# Altium schematic sheet Sheet3.SchDoc
size A4
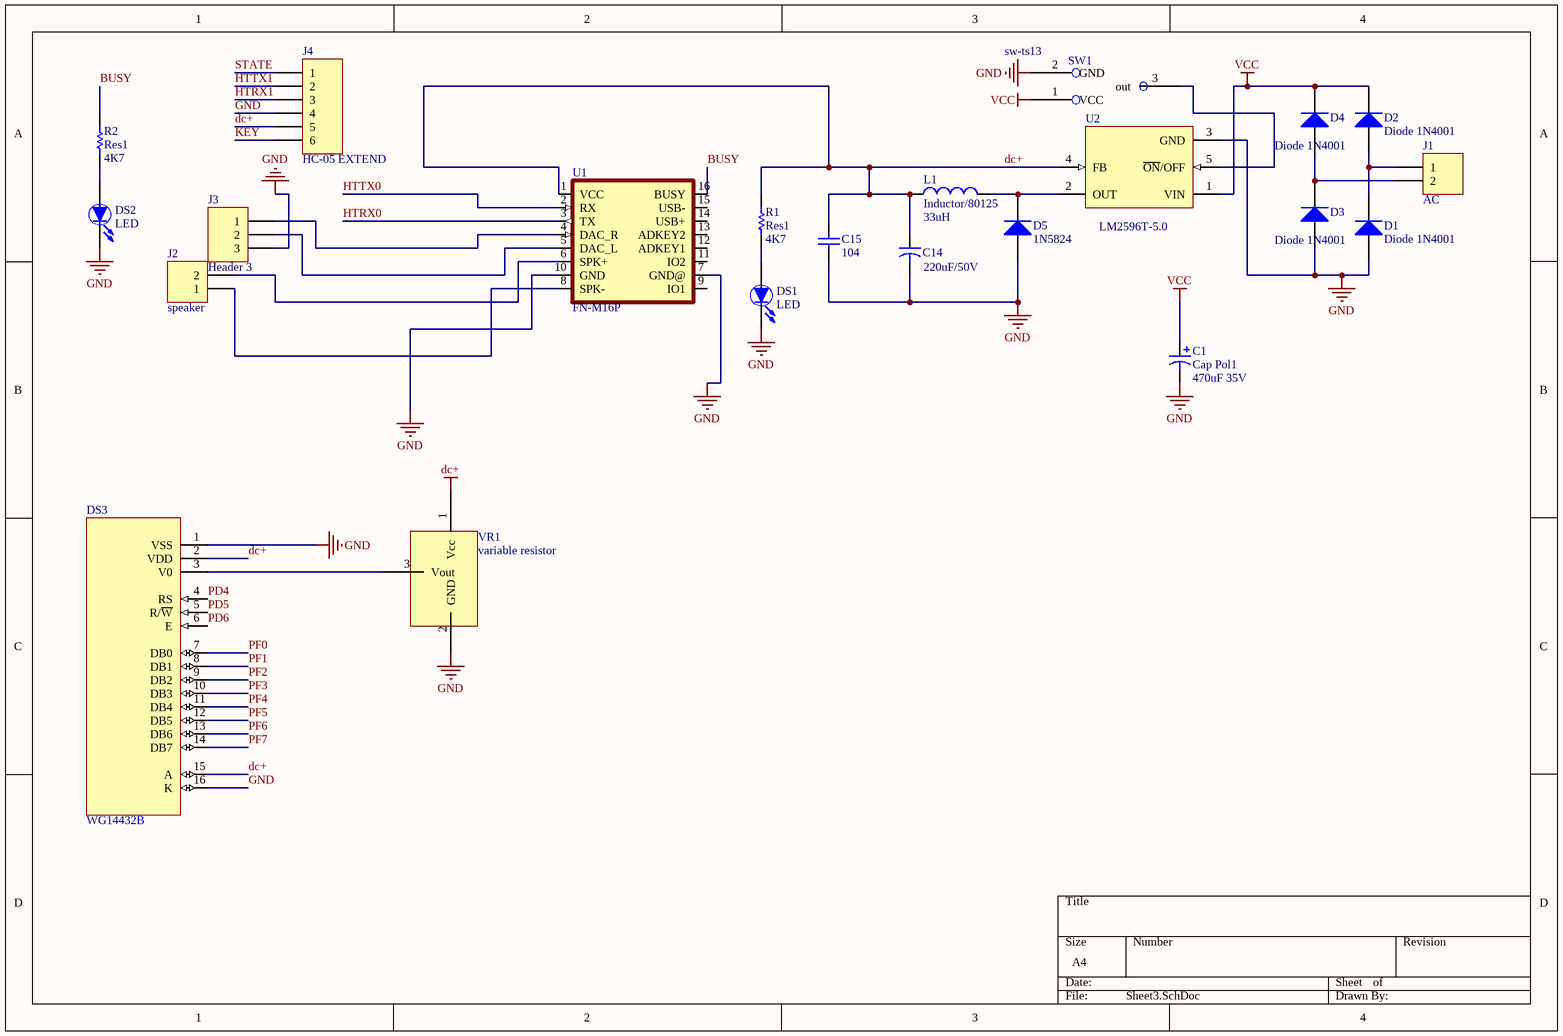
[diagram p0: Sheet3.SchDoc]

## Parts
C1  Cap Pol1  value 470uF 35V  [RB7.6-15]
C14  value 220uF/50V  [CAPR5-4X5]  (hidden comment: Cap2)
C15  104  [C200]
D1  Diode 1N4001  [DO-41]
D2  Diode 1N4001  [DO-41]
D3  Diode 1N4001  [DO-41]
D4  Diode 1N4001  [DO-41]
D5  1N5824  [DO-201AD]
DS1  LED  [LED-3mm_G]
DS2  LED  [LED-3mm_G]
DS3  WG14432B  [LCM_16]
J1  AC  [HDR1X2]
J2  speaker  [HDR1X2]
J3  Header 3  [HDR1X3]
J4  HC-05 EXTEND  [HDR1X6]
L1  Inductor/80125  value 33uH  [T080125]
R1  Res1  value 4K7  [AXIAL-0.3]
R2  Res1  value 4K7  [AXIAL-0.3]
SW1  sw-ts13  [TS-13]
U1  FN-M16P  [FN-M16P]
U2  LM2596T-5.0  [T05D]
VR1  variable resistor  [var_test]

## Nets
dc+: C14.1 C15.2 DS3.2(VDD) DS3.15(A) J4.5 L1.1 R1.2 U1.1(VCC) U2.4(FB) VR1.1(Vcc)
GND: C1.2 C14.2 C15.1 D1.1(A) D3.1(A) D5.1(A) DS1.2(K) DS2.2(K) DS3.1(VSS) DS3.16(K) J3.3 J4.4 SW1.2(GND) U1.7(GND@) U1.10(GND) U2.3(GND) VR1.2(GND)
VCC: C1.1 D2.2(K) D4.2(K) SW1.1(VCC) U2.1(VIN)
BUSY: R2.2 U1.16(BUSY)
HTRX0: U1.3(TX)
HTRX1: J4.3
HTTX0: U1.2(RX)
HTTX1: J4.2
KEY: J4.6
PD4: DS3.4(RS)
PD5: DS3.5(R/~{W})
PD6: DS3.6(E)
PF0: DS3.7(DB0)
PF1: DS3.8(DB1)
PF2: DS3.9(DB2)
PF3: DS3.10(DB3)
PF4: DS3.11(DB4)
PF5: DS3.12(DB5)
PF6: DS3.13(DB6)
PF7: DS3.14(DB7)
STATE: J4.1
NetD1_2: D1.2(K) D2.1(A) J1.1
NetD3_2: D3.2(K) D4.1(A) J1.2
NetD5_2: D5.2(K) L1.2 U2.2(OUT)
NetDS1_1: DS1.1(A) R1.1
NetDS2_1: DS2.1(A) R2.1
NetDS3_3: DS3.3(V0) VR1.3(Vout)
NetJ2_1: J2.1 U1.8(SPK-)
NetJ2_2: J2.2 U1.6(SPK+)
NetJ3_1: J3.1 U1.4(DAC_R)
NetJ3_2: J3.2 U1.5(DAC_L)
NetSW1_3: SW1.3(out) U2.5(~{ON}/OFF)

Not connected (* = marked no-connect by the designer): U1 9(IO1) 11(IO2) 12(ADKEY1) 13(ADKEY2) 14(USB+) 15(USB-)

## Library data of the parts
C1 = Cap Pol1: Polarized Capacitor (Radial); Published: 8-Jun-2000; LatestRevisionDate: 17-Jul-2002; LatestRevisionNote: Re-released for DXP Platform.; PackageReference: RB7.6-15; Publisher: Altium Limited; PackageDescription: Polarized Capacitor (Radial); 2 Leads
C14 = Cap2: Capacitor; Published: 23-Sep-2002; PackageReference: CAPR5-4X5; Publisher: Altium Limited; PackageDescription: Capacitor; 2 Leads
C15 = Cap: Capacitor; Published: 8-Jun-2000; LatestRevisionDate: 17-Jul-2002; LatestRevisionNote: Re-released for DXP Platform.; PackageReference: RAD-0.3; Publisher: Altium Limited
D1-D4 = Diode 1N4001: 1 Amp General Purpose Rectifier; Published: 8-Jun-2000; LatestRevisionDate: 17-Jul-2002; LatestRevisionNote: Re-released for DXP Platform.; DatasheetVersion: 1998; PackageVersion: Aug-1999; PackageReference: DO-41; Publisher: Altium Limited; PackageDescription: Diode, Axial; Body 5.2 x 2.7 mm (LxDia. max), Lead Dia. 0.86 mm (max); Code_JEDEC: DO-204-AL; ComponentLink1Description: Manufacturer Link; ComponentLink1URL: http://www.fairchildsemi.com/; ComponentLink2Description: Datasheet; ComponentLink2URL: http://www.fairchildsemi.com/ds/1N%2F1N4001.pdf
D5 = Diode 1N5408: 3 Amp Medium Power Silicon Rectifier Diode; Published: 8-Jun-2000; LatestRevisionDate: 17-Jul-2002; LatestRevisionNote: Re-released for DXP Platform.; DatasheetVersion: Aug-1984; PackageReference: DO-201AD; Publisher: Altium Limited; PackageDescription: Diode, Axial; Body 9.5 x 5.3 mm (LxDia. max), Lead Dia. 1.32 mm (max); ComponentLink1Description: Manufacturer Link; ComponentLink1URL: http://www.irf.com/
DS1 DS2 = LED: Typical INFRARED GaAs LED; Published: 8-Jun-2000; LatestRevisionDate: 08-Jul-2005; LatestRevisionNote: Mech Layer 1 removed.; PackageReference: LED-0; Publisher: Altium Limited
DS3 = WG14432B: LCD Module
J1 J2 = Header 2: Header, 2-Pin; LatestRevisionDate: 17-Jul-2002; LatestRevisionNote: Re-released for DXP Platform.; Publisher: Altium Limited
J3 = Header 3: Header, 3-Pin; LatestRevisionDate: 17-Jul-2002; LatestRevisionNote: Re-released for DXP Platform.; Publisher: Altium Limited
J4 = Header 6: Header, 6-Pin; LatestRevisionDate: 17-Jul-2002; LatestRevisionNote: Re-released for DXP Platform.; Publisher: Altium Limited
L1 = Inductor: Code_IEC: 1005; Published: 8-Jun-2000; LatestRevisionDate: 29-May-2009; LatestRevisionNote: IPC-7351 Footprint Added.; PackageReference: 0402-A; Publisher: Altium Limited; PackageDescription: Chip Inductor; Code_JEITA: 0402
R1 R2 = Res1: Resistor; Published: 8-Jun-2000; LatestRevisionDate: 17-Jul-2002; LatestRevisionNote: Re-released for DXP Platform.; PackageReference: AXIAL-0.3; Publisher: Altium Limited; PackageDescription: Axial Device, Thru-Hole; 2 Leads; 0.3 in Pin Spacing
U1 = FN-M16P: Embedded MP3 Audio Module; MF: Flyron Technology Co., Ltd.; SnapEDA_Link: https://www.snapeda.com/parts/FN-M16P/Flyron+Technology+Co.%252C+Ltd./view-part/?ref=snap; Package: Package; Price: None; MP: FN-M16P; Availability: Not in stock; Value: *; Check_prices: https://www.snapeda.com/parts/FN-M16P/Flyron+Technology+Co.%252C+Ltd./view-part/?ref=eda
U2 = LM2596T-5.0: SIMPLE SWITCHER?Power Converter 150 KHz 3A Step-Down Voltage Regulator, 5-pin TO-220; Manufacturer: National Semiconductor; PackageTopMarking: NSUZXYTTE#*LM2596T*-5.0 P+; PowerWise: N; Published: 4-Dec-2008; DatasheetVersion: May-2002; PackageVersion: revA, Oct-1989; PackageReference: T05D; Publisher: Altium Limited; PackageDescription: TO-220, Molded, Stagger Bend, 5 Lead; Supplier 1: Farnell; Supplier Part Number 1: 1206529; PartNumber: LM2596T-5.0; RoHS: N; PinCount: 5; CompType: Switcher; ComponentLink1Description: LM2596 Datasheet; ComponentLink1URL: http://www.national.com/ds/LM/LM2596.pdf; ComponentLink2Description: LM2596 Web Page; ComponentLink2URL: http://www.national.com/pf/LM/LM2596.html; ComponentLink3Description: T05D Package Page; ComponentLink3URL: http://www.national.com/packaging/folders/t05d.html